# Altium schematic sheet TheStaticTurtle_oshw-sdi3g-fiber__schematic_V4-Normal_OSHW_BiDi_SDI_Fiber_Converter_V4_Normal_2024-11-17__Power.schdoc
size 122 x 94 mm
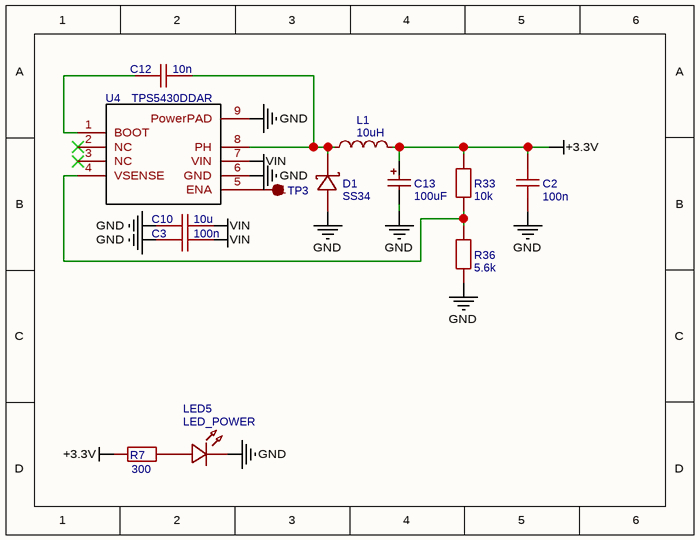
[diagram p0: TheStaticTurtle_oshw-sdi3g-fiber__schematic_V4-Normal_OSHW_BiDi_SDI_Fiber_Converter_V4_Normal_2024-11-17__Power.schdoc]

## Parts
C2  100n  [C0603]
C3  100n  [C0603]
C10  10u  [C0603]
C12  10n  [C0603]
C13  100uF  [CASE-B_3528]
D1  SS34  [SMA_L4.3-W2.6-LS5.2-RD]
L1  10uH  [IND-SMD_L4.0-W4.0]
LED5  LED_POWER  [LED0805_BLUE]
R7  300  [R0603]
R33  10k  [R0603]
R36  5.6k  [R0603]
TP3  TEST-POINT-PTH-1X1  [TESTPOINT-SMD_L1.6-W0.8_RCU-0C]  (value not drawn)
U4  TPS5430DDAR  [ESOP-8_L4.9-W3.9-P1.27-LS6.0-TL-EP]

## Nets
+3.3V: C2.2 C13.1 L1.2 R7.2 R33.1
GND: C2.1 C3.1 C10.1 C13.2 D1.2(A) LED5.2 R36.2 U4.6(GND) U4.9(PowerPAD)
VIN: C3.2 C10.2 U4.7(VIN)
NetC12_1: C12.1 U4.1(BOOT)
NetC12_2: C12.2 D1.1(K) L1.1 U4.8(PH)
NetLED5_1: LED5.1 R7.1
NetR33_2: R33.2 R36.1 U4.4(VSENSE)
NetTP3_1: TP3.1 U4.5(ENA)

Not connected (* = marked no-connect by the designer): U4 2(NC)* 3(NC)*

## Library data of the parts
C2 C3 = 100n: nameAlias: Value(F); Contributor: LCEDA_Lib; spicePre: C; spiceSymbolName: C_0603_US
C10 = 10u: nameAlias: Value(F); Contributor: LCEDA_Lib; spicePre: C; spiceSymbolName: C_0603_US
C12 = 10n: nameAlias: Value(F); Contributor: LCEDA_Lib; spicePre: C; spiceSymbolName: C_0603_US
C13 = 100uF: Manufacturer: Kyocera AVX; Manufacturer Part: TAJB107K006RNJ; nameAlias: Value; Supplier: LCSC; Supplier Part: C16133; JLCPCB Part Class: Basic Part; spicePre: C; spiceSymbolName: TAJB107K006RNJ
D1 = SS34: Manufacturer: MDD(辰达半导体); Supplier: LCSC; Manufacturer Part: SS34; Supplier Part: C8678; spicePre: D; spiceSymbolName: SS34_C8678
L1 = 10uH: Manufacturer: Sunlord(顺络); Manufacturer Part: SWPA4030S100MT; nameAlias: Value; Supplier: LCSC; Supplier Part: C38117; JLCPCB Part Class: Extended Part; spicePre: L; spiceSymbolName: SWPA4030S100MT
LED5 = LED_POWER: Manufacturer: 方舟 ARKLED; Manufacturer Part: D-B080508B1-KS2; Contributor: LCEDA_Lib; Supplier Part: C108412; spicePre: L; spiceSymbolName: LED-0805_B
R7 = 300: nameAlias: Value(Ω); Contributor: LCEDA_Lib; spicePre: R; spiceSymbolName: R_0603_EU
R33 = 10k: nameAlias: Value(Ω); Contributor: LCEDA_Lib; spicePre: R; spiceSymbolName: R_0603_EU
R36 = 5.6k: nameAlias: Value(Ω); Contributor: LCEDA_Lib; spicePre: R; spiceSymbolName: R_0603_EU
U4 = TPS5430DDAR: Manufacturer: TI(德州仪器); Supplier: LCSC; Manufacturer Part: TPS5430DDAR; Supplier Part: C9864; JLCPCB Part Class: Basic Part; spicePre: U; spiceSymbolName: TPS5430DDAR
TP3 = TEST-POINT-PTH-1X1: spicePre: T; spiceSymbolName: TEST-POINT-PTH-1X1